# Altium schematic sheet Supply_Fusing.SchDoc: Supply and Fusing
size A4; CheckedBy: Nico Bieberich; Author: Nico Bieberich; Organization: Baltic Racing; Address1: Zur Schwedenschanze 15; Address2: Haus 18; Address3: 18435 Stralsund; Revision: xx.xx; SheetNumber: 2; SheetTotal: 6; Rules: LVS
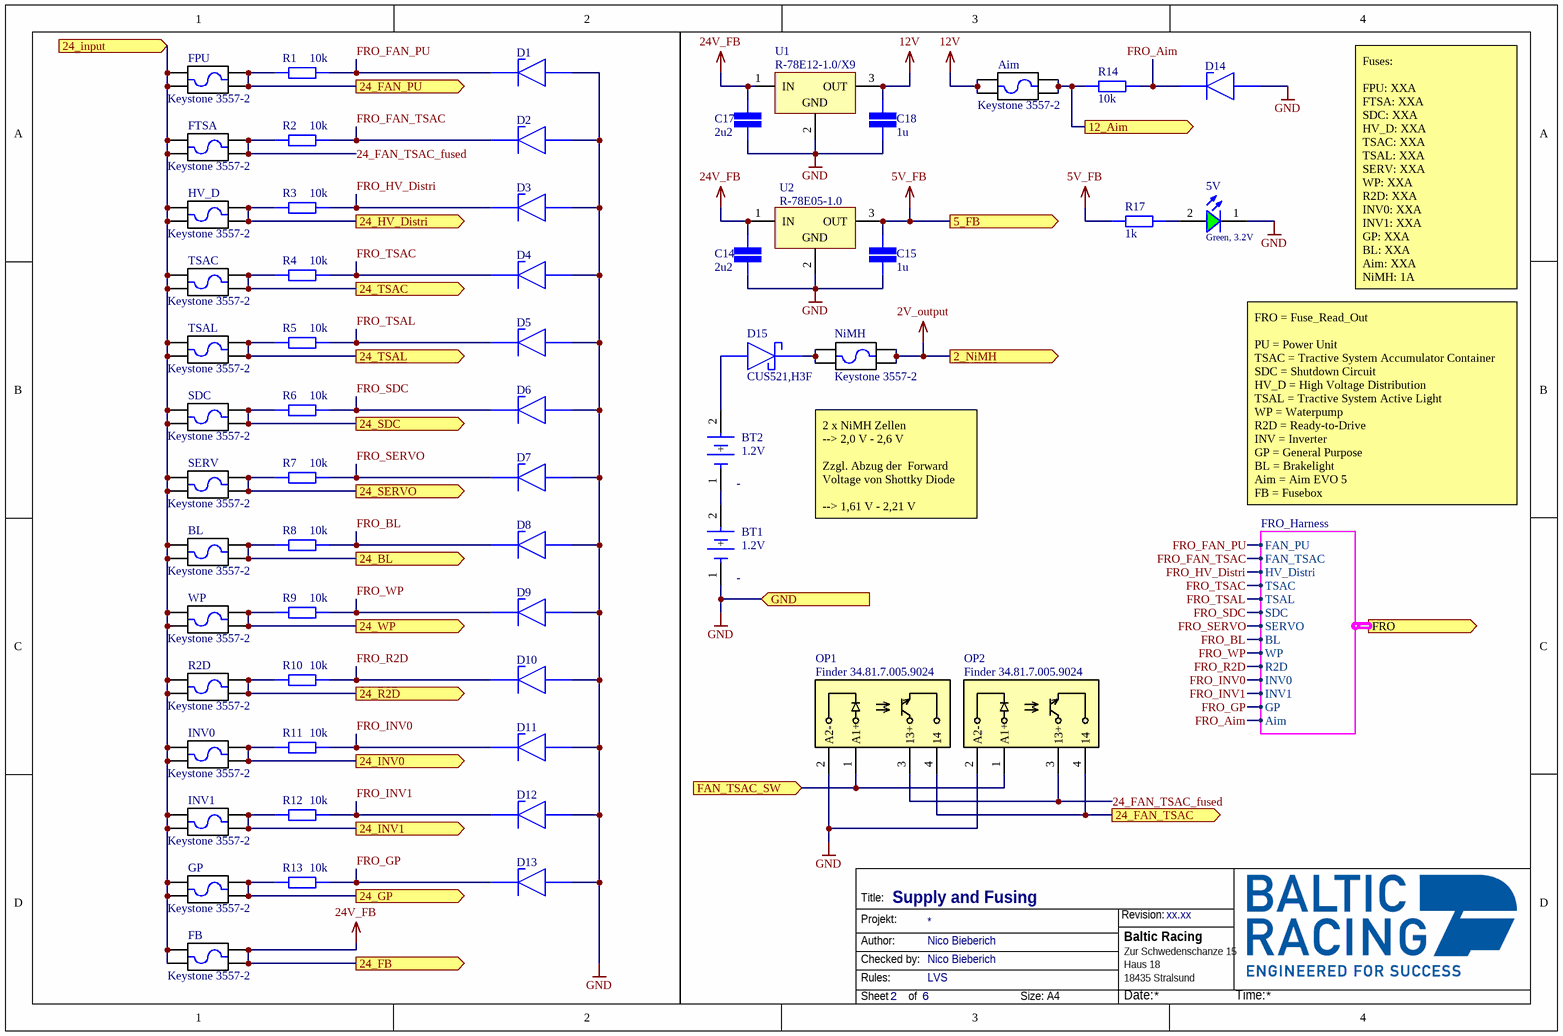
[diagram p0: Supply_Fusing.SchDoc]

## Parts
5V  Green, 3.2V  [WL-SMCW_0603_H=0.7mm]
Aim  Keystone 3557-2  [Keystone 3557-2]
BL  Keystone 3557-2  [Keystone 3557-2]
BT1  Voltage: 1.2V  [Keystone_1020_0]  (hidden comment: Keystone 1020)
BT2  Voltage: 1.2V  [Keystone_1020_0]  (hidden comment: Keystone 1020)
C14  value 2u2  [CAP 0603/1608]  (hidden comment: SMD Capacitor)
C15  value 1u  [CAP 0603/1608]  (hidden comment: SMD Capacitor)
C17  value 2u2  [CAP 0603/1608]  (hidden comment: SMD Capacitor)
C18  value 1u  [CAP 0603/1608]  (hidden comment: SMD Capacitor)
D1  MM3Z4V7T1G  [SOD-323-2]  (value not drawn)
D2  MM3Z4V7T1G  [SOD-323-2]  (value not drawn)
D3  MM3Z4V7T1G  [SOD-323-2]  (value not drawn)
D4  MM3Z4V7T1G  [SOD-323-2]  (value not drawn)
D5  MM3Z4V7T1G  [SOD-323-2]  (value not drawn)
D6  MM3Z4V7T1G  [SOD-323-2]  (value not drawn)
D7  MM3Z4V7T1G  [SOD-323-2]  (value not drawn)
D8  MM3Z4V7T1G  [SOD-323-2]  (value not drawn)
D9  MM3Z4V7T1G  [SOD-323-2]  (value not drawn)
D10  MM3Z4V7T1G  [SOD-323-2]  (value not drawn)
D11  MM3Z4V7T1G  [SOD-323-2]  (value not drawn)
D12  MM3Z4V7T1G  [SOD-323-2]  (value not drawn)
D13  MM3Z4V7T1G  [SOD-323-2]  (value not drawn)
D14  MM3Z4V7T1G  [SOD-323-2]  (value not drawn)
D15  CUS521,H3F  [SOD-323-2]
FB  Keystone 3557-2  [Keystone 3557-2]
FPU  Keystone 3557-2  [Keystone 3557-2]
FTSA  Keystone 3557-2  [Keystone 3557-2]
GP  Keystone 3557-2  [Keystone 3557-2]
HV_D  Keystone 3557-2  [Keystone 3557-2]
INV0  Keystone 3557-2  [Keystone 3557-2]
INV1  Keystone 3557-2  [Keystone 3557-2]
NiMH  Keystone 3557-2  [Keystone 3557-2]
OP1  Finder 34.81.7.005.9024  [Finder 34.81 Series]
OP2  Finder 34.81.7.005.9024  [Finder 34.81 Series]
R1  value 10k  [STACKPOLE CSR0603]  (hidden comment: SMD Resistor)
R2  value 10k  [STACKPOLE CSR0603]  (hidden comment: SMD Resistor)
R2D  Keystone 3557-2  [Keystone 3557-2]
R3  value 10k  [STACKPOLE CSR0603]  (hidden comment: SMD Resistor)
R4  value 10k  [STACKPOLE CSR0603]  (hidden comment: SMD Resistor)
R5  value 10k  [STACKPOLE CSR0603]  (hidden comment: SMD Resistor)
R6  value 10k  [STACKPOLE CSR0603]  (hidden comment: SMD Resistor)
R7  value 10k  [STACKPOLE CSR0603]  (hidden comment: SMD Resistor)
R8  value 10k  [STACKPOLE CSR0603]  (hidden comment: SMD Resistor)
R9  value 10k  [STACKPOLE CSR0603]  (hidden comment: SMD Resistor)
R10  value 10k  [STACKPOLE CSR0603]  (hidden comment: SMD Resistor)
R11  value 10k  [STACKPOLE CSR0603]  (hidden comment: SMD Resistor)
R12  value 10k  [STACKPOLE CSR0603]  (hidden comment: SMD Resistor)
R13  value 10k  [STACKPOLE CSR0603]  (hidden comment: SMD Resistor)
R14  value 10k  [STACKPOLE CSR0603]  (hidden comment: SMD Resistor)
R17  value 1k  [STACKPOLE CSR0603]  (hidden comment: SMD Resistor)
SDC  Keystone 3557-2  [Keystone 3557-2]
SERV  Keystone 3557-2  [Keystone 3557-2]
TSAC  Keystone 3557-2  [Keystone 3557-2]
TSAL  Keystone 3557-2  [Keystone 3557-2]
U1  R-78E12-1.0/X9  [SIP3_RECOM]
U2  R-78E05-1.0  [SIP3_RECOM]
WP  Keystone 3557-2  [Keystone 3557-2]

## Ports
2_NiMH (out), 5_FB (out), 12_Aim (out), 24_BL (out), 24_FAN_PU (out), 24_FAN_TSAC (out), 24_FB (out), 24_GP (out), 24_HV_Distri (out), 24_input (in), 24_INV0 (out), 24_INV1 (out), 24_R2D (out), 24_SDC (out), 24_SERVO (out), 24_TSAC (out), 24_TSAL (out), 24_WP (out), FAN_TSAC_SW (in), FRO (out, harness FRO_Harness), GND (in)

## Harnesses
FRO_Harness: GP, HV_Distri, BL, SDC, FAN_TSAC, FAN_PU, WP, TSAL, TSAC, INV0, INV1, Aim, SERVO, R2D

## Nets
2V_output: NiMH.O1 NiMH.O2 ; port 2_NiMH
5V_FB: C15.2 R17.2 U2.3(OUT) ; port 5_FB
12V: Aim.I1 Aim.I2 C18.2 U1.3(OUT)
24V_FB: C14.2 C17.2 FB.O1 FB.O2 U1.1(IN) U2.1(IN) ; port 24_FB
GND: 5V.1(K) BT1.1(-) C14.1 C15.1 C17.1 C18.1 D1.2A(A) D2.2A(A) D3.2A(A) D4.2A(A) D5.2A(A) D6.2A(A) D7.2A(A) D8.2A(A) D9.2A(A) D10.2A(A) D11.2A(A) D12.2A(A) D13.2A(A) D14.2A(A) OP1.2(A2-) OP2.2(A2-) U1.2(GND) U2.2(GND) ; port GND
12_Aim: Aim.O1 Aim.O2 R14.2 ; port 12_Aim
24_BL: BL.O1 BL.O2 R8.2 ; port 24_BL
24_FAN_PU: FPU.O1 FPU.O2 R1.2 ; port 24_FAN_PU
24_FAN_TSAC: OP1.4(14) OP2.4(14) ; port 24_FAN_TSAC
24_FAN_TSAC_fused: FTSA.O1 FTSA.O2 OP1.3(13+) OP2.3(13+) R2.2
24_GP: GP.O1 GP.O2 R13.2 ; port 24_GP
24_HV_Distri: HV_D.O1 HV_D.O2 R3.2 ; port 24_HV_Distri
24_input: BL.I1 BL.I2 FB.I1 FB.I2 FPU.I1 FPU.I2 FTSA.I1 FTSA.I2 GP.I1 GP.I2 HV_D.I1 HV_D.I2 INV0.I1 INV0.I2 INV1.I1 INV1.I2 R2D.I1 R2D.I2 SDC.I1 SDC.I2 SERV.I1 SERV.I2 TSAC.I1 TSAC.I2 TSAL.I1 TSAL.I2 WP.I1 WP.I2 ; port 24_input
24_INV0: INV0.O1 INV0.O2 R11.2 ; port 24_INV0
24_INV1: INV1.O1 INV1.O2 R12.2 ; port 24_INV1
24_R2D: R2D.O1 R2D.O2 R10.2 ; port 24_R2D
24_SDC: R6.2 SDC.O1 SDC.O2 ; port 24_SDC
24_SERVO: R7.2 SERV.O1 SERV.O2 ; port 24_SERVO
24_TSAC: R4.2 TSAC.O1 TSAC.O2 ; port 24_TSAC
24_TSAL: R5.2 TSAL.O1 TSAL.O2 ; port 24_TSAL
24_WP: R9.2 WP.O1 WP.O2 ; port 24_WP
FAN_TSAC_SW: OP1.1(A1+) OP2.1(A1+) ; port FAN_TSAC_SW
FRO_Aim: D14.1C(C) R14.1 ; port FRO.Aim
FRO_BL: D8.1C(C) R8.1 ; port FRO.BL
FRO_FAN_PU: D1.1C(C) R1.1 ; port FRO.FAN_PU
FRO_FAN_TSAC: D2.1C(C) R2.1 ; port FRO.FAN_TSAC
FRO_GP: D13.1C(C) R13.1 ; port FRO.GP
FRO_HV_Distri: D3.1C(C) R3.1 ; port FRO.HV_Distri
FRO_INV0: D11.1C(C) R11.1 ; port FRO.INV0
FRO_INV1: D12.1C(C) R12.1 ; port FRO.INV1
FRO_R2D: D10.1C(C) R10.1 ; port FRO.R2D
FRO_SDC: D6.1C(C) R6.1 ; port FRO.SDC
FRO_SERVO: D7.1C(C) R7.1 ; port FRO.SERVO
FRO_TSAC: D4.1C(C) R4.1 ; port FRO.TSAC
FRO_TSAL: D5.1C(C) R5.1 ; port FRO.TSAL
FRO_WP: D9.1C(C) R9.1 ; port FRO.WP
Net5V_2: 5V.2(A) R17.1
NetBT1_2: BT1.2(+) BT2.1(-)
NetBT2_2: BT2.2(+) D15.2A(A)
NetD15_1C: D15.1C(C) NiMH.I1 NiMH.I2

## Notes on the sheet
- Fuses:
  FPU: XXA
  FTSA: XXA
  SDC: XXA
  HV_D: XXA
  TSAC: XXA
  TSAL: XXA
  SERV: XXA
  WP: XXA
  R2D: XXA
  INV0: XXA
  INV1: XXA
  GP: XXA
  BL: XXA
  Aim: XXA
  NiMH: 1A
- 2 x NiMH Zellen
  --> 2,0 V - 2,6 V
  Zzgl. Abzug der  Forward Voltage von Shottky Diode
  --> 1,61 V - 2,21 V
- FRO = Fuse_Read_Out
  PU = Power Unit
  TSAC = Tractive System Accumulator Container
  SDC = Shutdown Circuit
  HV_D = High Voltage Distribution
  TSAL = Tractive System Active Light
  WP = Waterpump
  R2D = Ready-to-Drive
  INV = Inverter
  GP = General Purpose
  BL = Brakelight
  Aim = Aim EVO 5
  FB = Fusebox
- Title:
- Projekt:
- Revision:
- Author:
- Rules:
- Checked by:
- Sheet
- of
- Size:
- A4
- Date:
- Time:

## Library data of the parts
5V = 150060GS75000: WL-SMCW SMT Mono-color Chip LED Waterclear, size 0603, Green, 3.2V, 140deg; Chip Technology: InGaN; Dominant Wavelength typ.: 525nm; Luminous Intensity typ.: 430mcd; Peak Wavelength typ.: 515nm; Viewing Angle: 140deg; ComponentLink1Description: Manufacturer; ComponentLink1URL: http://www.we-online.de; ComponentLink2URL: https://www.we-online.com/catalog/datasheet/150060GS75000.pdf; ComponentLink2Description: Datasheet; Forward Voltage typ.: 3.2V; Emitting Color: Green; Mounting Technology: SMT; Operating Temperature: -40 to +85degC; Published Date: December 2019; Part Number: 150060GS75000; Packaging: Tape and Reel; Size: 0603; Publisher: Wurth Elektronik
Aim BL FB FPU FTSA GP HV_D INV0 INV1 NiMH R2D SDC SERV TSAC TSAL WP = Keystone 3557-2: Keystone 3557-2 / Fuse Holder; ComponentLink1Description: Octopart; ComponentLink1URL: https://octopart.com/3557-2-keystone-850400?r=sp
BT1 BT2 = Keystone 1020: BATT HOLDER BATTERY AAA SMD; Part Number: 1020; helpURL: https://upverter.com/upn/revision/aeadfed39ba6ac98/; ComponentLink2Description: Datasheet; Temperature: -50°C to +145°C; Package: BT_HLDR_SMT; Supplier 2: Mouser; Price: 1.62889830371; Supplier 1: Digi-Key; ComponentLink1URL: https://upverter.com/upn/revision/aeadfed39ba6ac98/; Supplier Part Number 2: 534-1020; Supplier Part Number 1: 36-1020-ND; Manufacturer: Keystone; ComponentLink1Description: Upverter; ComponentLink2URL: http://www.keyelco.com/product-pdf.cfm?p=934; RoHS: TRUE; Mouser Part Number: 534-1020; Temperature Range High: +145°C; Digikey Description: BATT HOLDER BATTERY AAA SMD; Digikey Part Number: 36-1020-ND; Lead Free: yes; Temperature Range Low: -50°C
C14 C17 = SMD Capacitor: Capacitor with multiple Footprints; Voltage: 50
C15 C18 = SMD Capacitor: Capacitor with multiple Footprints; Voltage: 16
D1-D14 = MM3Z4V7T1G: onsemi MM3Z4V7T1G / Z-Diode, 4,7V; ComponentLink1Description: Octopart; ComponentLink1URL: https://octopart.com/mm3z4v7t1g-onsemi-331144?r=sp
D15 = CUS521,H3F: Toshiba CUS521,H3F / Shottky-Diode / Forward: 390mV, Reverse: 30V; ComponentLink1Description: Octopart; ComponentLink1URL: https://octopart.com/cus521%2Ch3f-toshiba-26712463?r=sp
OP1 OP2 = Finder 34.81 Series: Opto-Isolator / Finder 34.81 series; ComponentLink1Description: Finder; ComponentLink1URL: https://www.findernet.com/de/deutschland/series/serie-34-schmales-steck-printrelais-emr-oder-ssr-01-2-6a/
R1-R14 R17 = SMD Resistor: Resistor with multiple footprints; Power: 0.1W
U1 U2 = R-78E05-1.0: Nonisolated 5V Switchmode converter